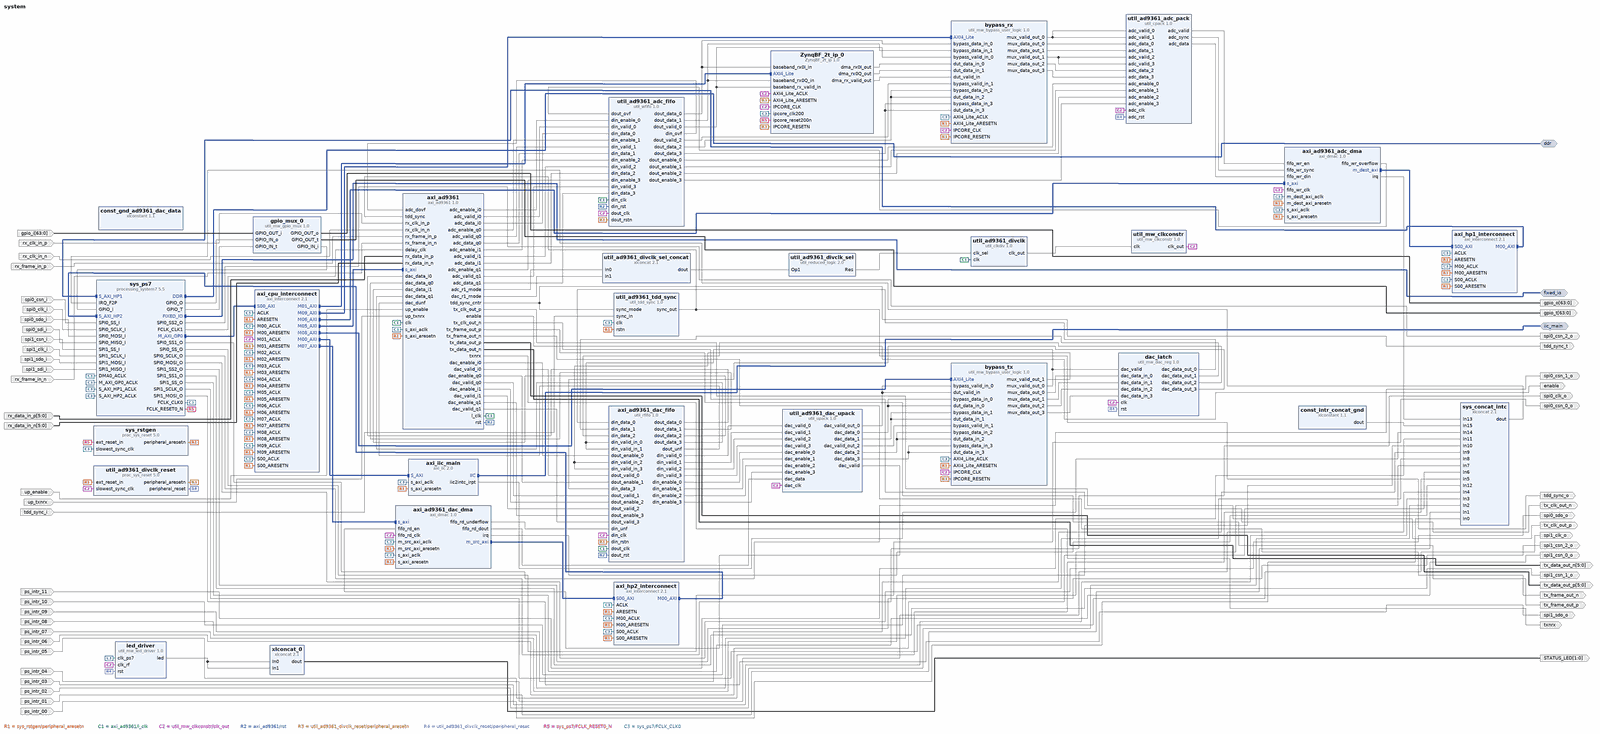
[diagram p0: block diagram of the top level, whole]
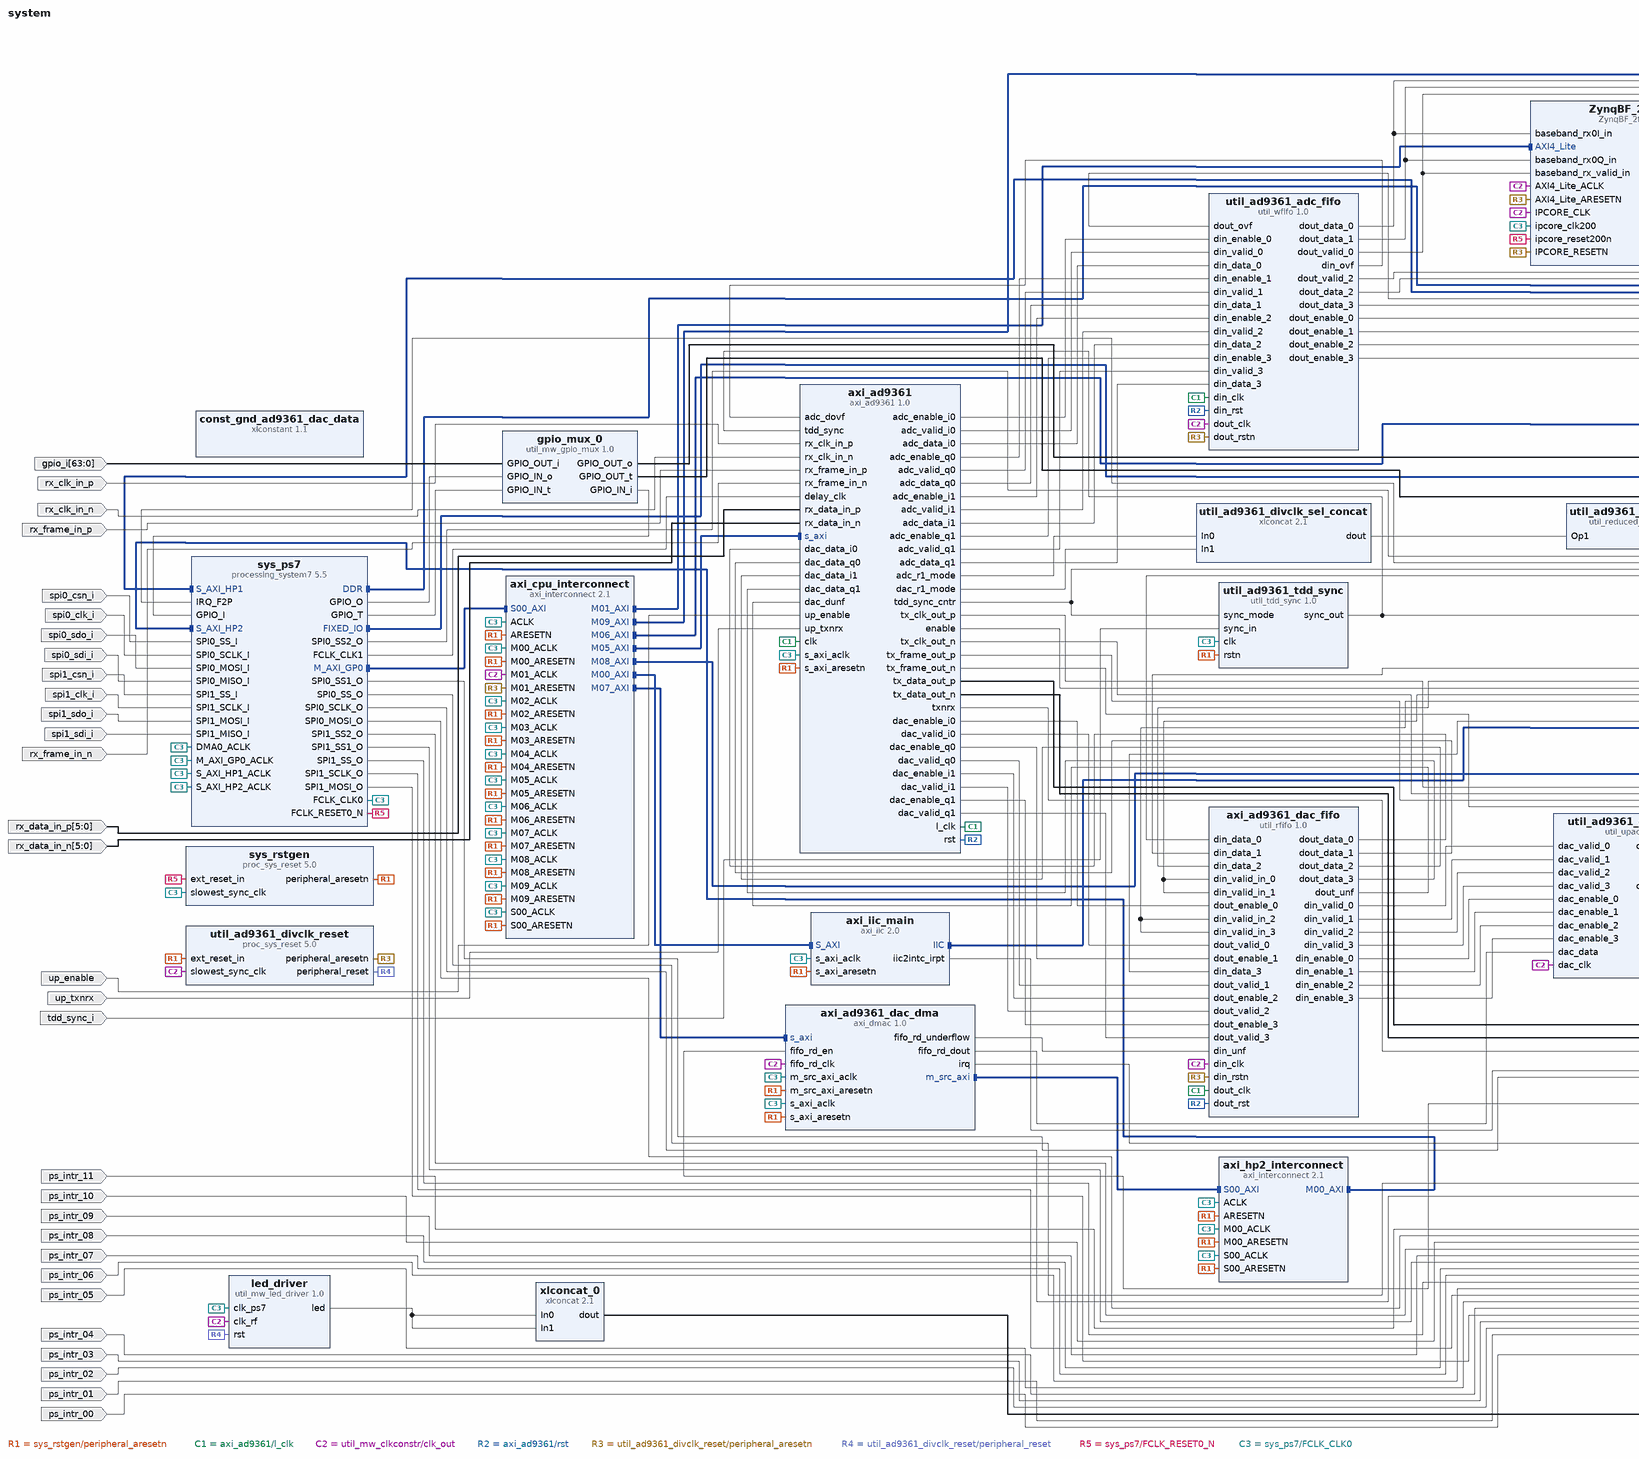
[diagram p1: block diagram of the top level, left part]
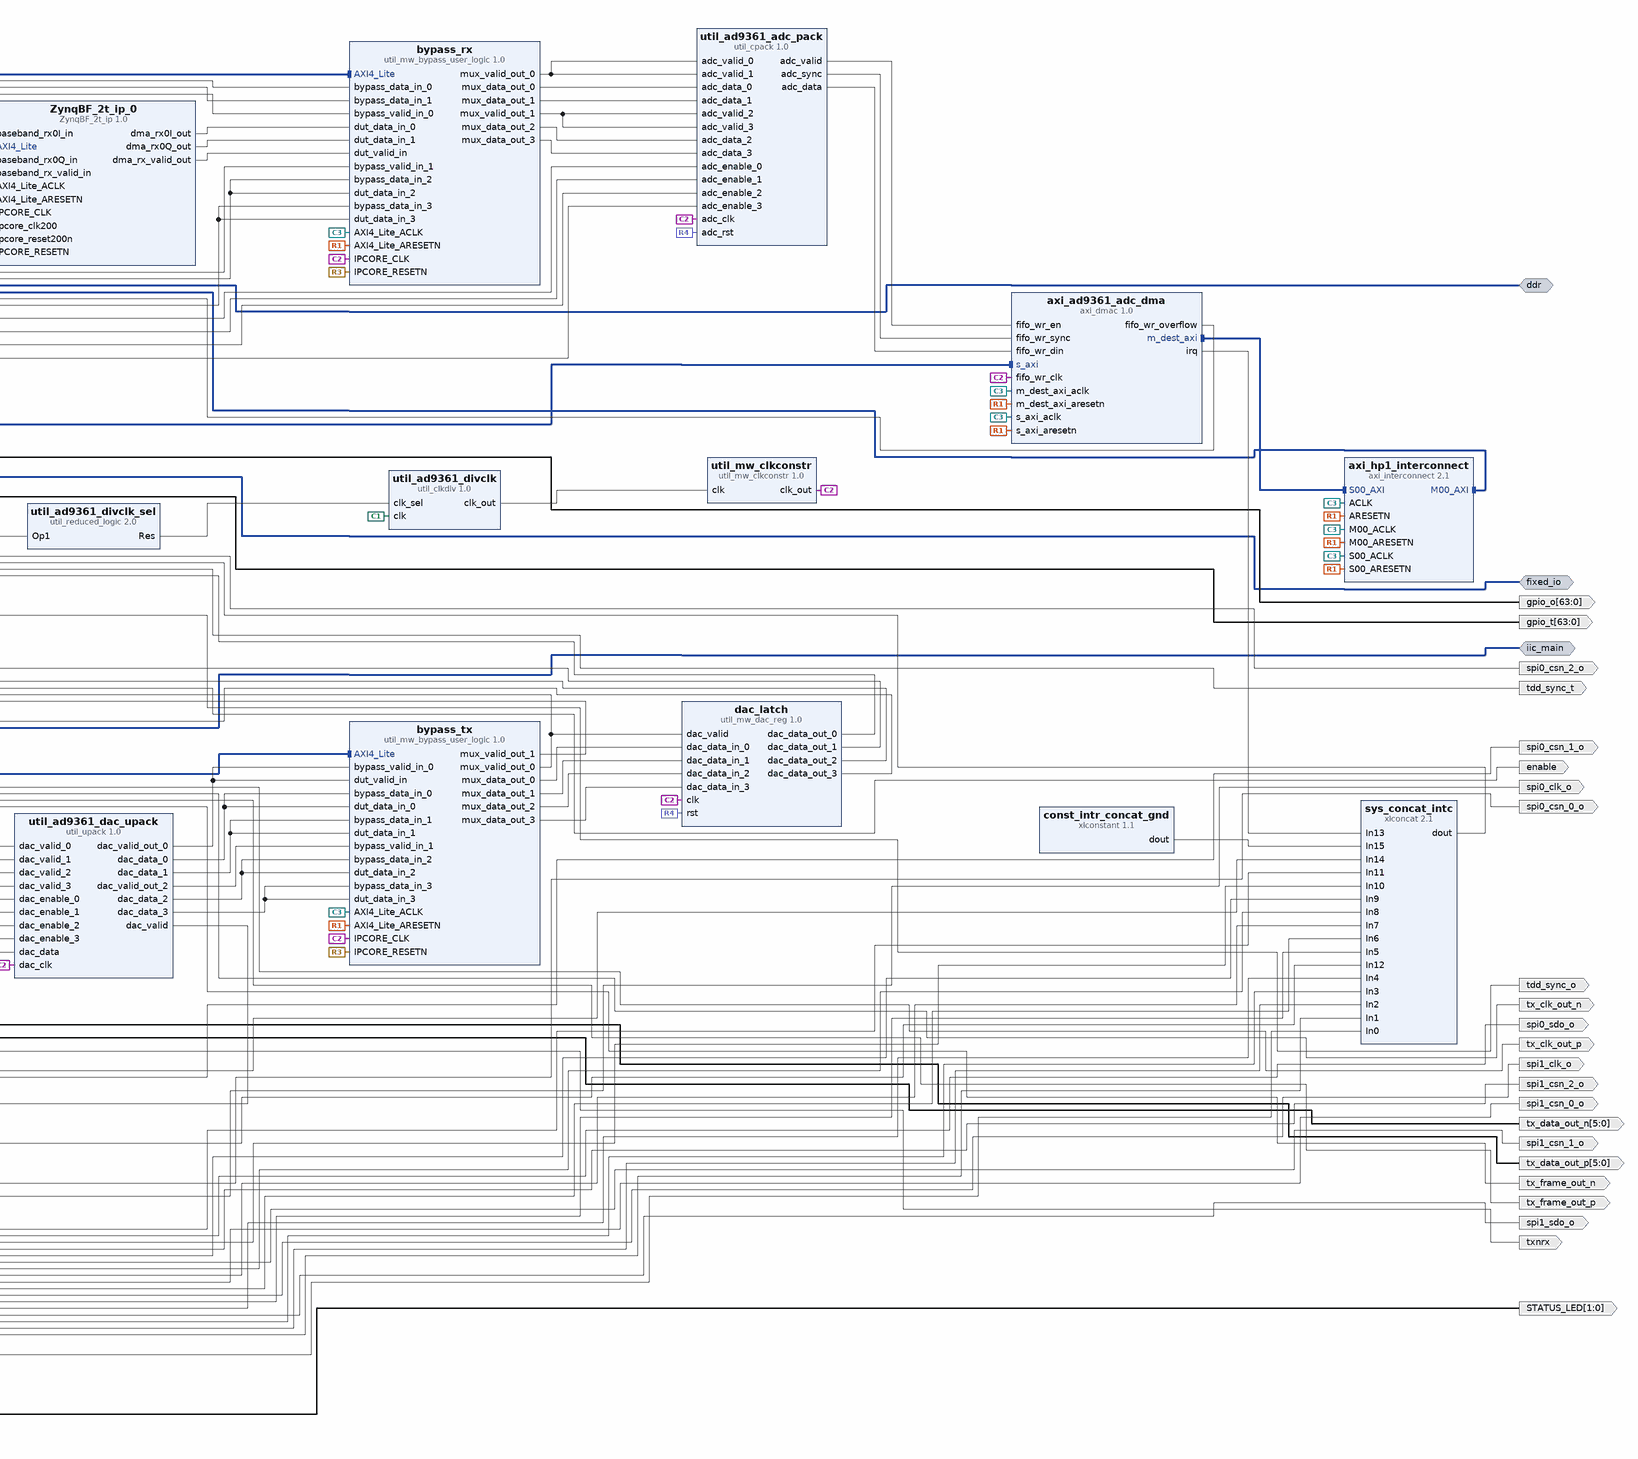
[diagram p2: block diagram of the top level, right part]
# Vivado block design system, xc7z045ffg900-2, Vivado 2017.4
create_bd_design system

create_bd_intf_port -mode Master -vlnv xilinx.com:interface:ddrx_rtl:1.0 ddr
create_bd_intf_port -mode Master -vlnv xilinx.com:interface:iic_rtl:1.0 iic_main
create_bd_intf_port -mode Master -vlnv xilinx.com:display_processing_system7:fixedio_rtl:1.0 fixed_io
create_bd_port -dir I -from 63 -to 0 gpio_i
create_bd_port -dir O -from 63 -to 0 gpio_o
create_bd_port -dir O -from 63 -to 0 gpio_t
create_bd_port -dir O spi0_csn_2_o
create_bd_port -dir O spi0_csn_1_o
create_bd_port -dir O spi0_csn_0_o
create_bd_port -dir I spi0_csn_i
create_bd_port -dir I spi0_clk_i
create_bd_port -dir O spi0_clk_o
create_bd_port -dir I spi0_sdo_i
create_bd_port -dir O spi0_sdo_o
create_bd_port -dir I spi0_sdi_i
create_bd_port -dir O spi1_csn_2_o
create_bd_port -dir O spi1_csn_1_o
create_bd_port -dir O spi1_csn_0_o
create_bd_port -dir I spi1_csn_i
create_bd_port -dir I spi1_clk_i
create_bd_port -dir O spi1_clk_o
create_bd_port -dir I spi1_sdo_i
create_bd_port -dir O spi1_sdo_o
create_bd_port -dir I spi1_sdi_i
create_bd_port -dir I -type intr ps_intr_11
create_bd_port -dir I -type intr ps_intr_10
create_bd_port -dir I -type intr ps_intr_09
create_bd_port -dir I -type intr ps_intr_08
create_bd_port -dir I -type intr ps_intr_07
create_bd_port -dir I -type intr ps_intr_06
create_bd_port -dir I -type intr ps_intr_05
create_bd_port -dir I -type intr ps_intr_04
create_bd_port -dir I -type intr ps_intr_03
create_bd_port -dir I -type intr ps_intr_02
create_bd_port -dir I -type intr ps_intr_01
create_bd_port -dir I -type intr ps_intr_00
create_bd_port -dir I rx_clk_in_p
create_bd_port -dir I rx_clk_in_n
create_bd_port -dir I rx_frame_in_p
create_bd_port -dir I rx_frame_in_n
create_bd_port -dir I -from 5 -to 0 rx_data_in_p
create_bd_port -dir I -from 5 -to 0 rx_data_in_n
create_bd_port -dir O tx_clk_out_p
create_bd_port -dir O tx_clk_out_n
create_bd_port -dir O tx_frame_out_p
create_bd_port -dir O tx_frame_out_n
create_bd_port -dir O -from 5 -to 0 tx_data_out_p
create_bd_port -dir O -from 5 -to 0 tx_data_out_n
create_bd_port -dir O enable
create_bd_port -dir O txnrx
create_bd_port -dir I up_enable
create_bd_port -dir I up_txnrx
create_bd_port -dir O tdd_sync_o
create_bd_port -dir O tdd_sync_t
create_bd_port -dir I tdd_sync_i
create_bd_port -dir O -from 1 -to 0 STATUS_LED

create_bd_cell -type ip -vlnv xilinx.com:ip:processing_system7:5.5 sys_ps7
set_property -dict [list \
  CONFIG.PCW_FCLK_CLK1_BUF TRUE \
  CONFIG.PCW_FCLK_CLK2_BUF TRUE \
  CONFIG.PCW_UIPARAM_DDR_FREQ_MHZ 533.333313 \
  CONFIG.PCW_APU_PERIPHERAL_FREQMHZ 667.000000 \
  CONFIG.PCW_SDIO_PERIPHERAL_FREQMHZ 50 \
  CONFIG.PCW_UART_PERIPHERAL_FREQMHZ 50 \
  CONFIG.PCW_I2C_PERIPHERAL_FREQMHZ 111.111115 \
  CONFIG.PCW_FPGA0_PERIPHERAL_FREQMHZ 100.0 \
  CONFIG.PCW_FPGA1_PERIPHERAL_FREQMHZ 200.0 \
  CONFIG.PCW_USE_S_AXI_HP1 1 \
  CONFIG.PCW_USE_S_AXI_HP2 1 \
  CONFIG.PCW_USE_DMA0 1 \
  CONFIG.PCW_USE_FABRIC_INTERRUPT 1 \
  CONFIG.PCW_EN_CLK1_PORT 1 \
  CONFIG.PCW_EN_CLK2_PORT 1 \
  CONFIG.PCW_EN_RST1_PORT 1 \
  CONFIG.PCW_EN_RST2_PORT 1 \
  CONFIG.PCW_IRQ_F2P_INTR 1 \
  CONFIG.PCW_IRQ_F2P_MODE REVERSE \
  CONFIG.PCW_PRESET_BANK0_VOLTAGE {LVCMOS 1.8V} \
  CONFIG.PCW_PRESET_BANK1_VOLTAGE {LVCMOS 1.8V} \
  CONFIG.PCW_UIPARAM_DDR_PARTNO Custom \
  CONFIG.PCW_QSPI_PERIPHERAL_ENABLE 1 \
  CONFIG.PCW_QSPI_QSPI_IO {MIO 1 .. 6} \
  CONFIG.PCW_QSPI_GRP_SINGLE_SS_ENABLE 0 \
  CONFIG.PCW_DUAL_PARALLEL_QSPI_DATA_MODE x8 \
  CONFIG.PCW_QSPI_GRP_IO1_ENABLE 1 \
  CONFIG.PCW_QSPI_GRP_IO1_IO {MIO 0 9 .. 13} \
  CONFIG.PCW_QSPI_GRP_FBCLK_ENABLE 1 \
  CONFIG.PCW_QSPI_GRP_FBCLK_IO {MIO 8} \
  CONFIG.PCW_QSPI_INTERNAL_HIGHADDRESS 0xFDFFFFFF \
  CONFIG.PCW_ENET0_PERIPHERAL_ENABLE 1 \
  CONFIG.PCW_ENET0_ENET0_IO {MIO 16 .. 27} \
  CONFIG.PCW_ENET0_GRP_MDIO_ENABLE 1 \
  CONFIG.PCW_ENET0_GRP_MDIO_IO {MIO 52 .. 53} \
  CONFIG.PCW_ENET_RESET_ENABLE 1 \
  CONFIG.PCW_ENET_RESET_SELECT {Share reset pin} \
  CONFIG.PCW_ENET0_RESET_ENABLE 1 \
  CONFIG.PCW_ENET0_RESET_IO {MIO 47} \
  CONFIG.PCW_SD0_PERIPHERAL_ENABLE 1 \
  CONFIG.PCW_SD0_SD0_IO {MIO 40 .. 45} \
  CONFIG.PCW_SD0_GRP_CD_ENABLE 1 \
  CONFIG.PCW_SD0_GRP_CD_IO {MIO 14} \
  CONFIG.PCW_SD0_GRP_WP_ENABLE 1 \
  CONFIG.PCW_SD0_GRP_WP_IO {MIO 15} \
  CONFIG.PCW_UART1_PERIPHERAL_ENABLE 1 \
  CONFIG.PCW_UART1_UART1_IO {MIO 48 .. 49} \
  CONFIG.PCW_SPI0_PERIPHERAL_ENABLE 1 \
  CONFIG.PCW_SPI0_SPI0_IO EMIO \
  CONFIG.PCW_SPI1_PERIPHERAL_ENABLE 1 \
  CONFIG.PCW_SPI1_SPI1_IO EMIO \
  CONFIG.PCW_USB0_PERIPHERAL_ENABLE 1 \
  CONFIG.PCW_USB0_USB0_IO {MIO 28 .. 39} \
  CONFIG.PCW_USB_RESET_ENABLE 1 \
  CONFIG.PCW_USB_RESET_SELECT {Share reset pin} \
  CONFIG.PCW_USB0_RESET_ENABLE 1 \
  CONFIG.PCW_USB0_RESET_IO {MIO 7} \
  CONFIG.PCW_I2C0_PERIPHERAL_ENABLE 1 \
  CONFIG.PCW_I2C0_I2C0_IO {MIO 50 .. 51} \
  CONFIG.PCW_I2C0_GRP_INT_ENABLE 0 \
  CONFIG.PCW_I2C0_RESET_ENABLE 1 \
  CONFIG.PCW_I2C0_RESET_IO {MIO 46} \
  CONFIG.PCW_I2C_RESET_ENABLE 1 \
  CONFIG.PCW_I2C_RESET_SELECT {Share reset pin} \
  CONFIG.PCW_GPIO_MIO_GPIO_ENABLE 1 \
  CONFIG.PCW_GPIO_MIO_GPIO_IO MIO \
  CONFIG.PCW_GPIO_EMIO_GPIO_ENABLE 1 \
  CONFIG.PCW_GPIO_EMIO_GPIO_IO 64 \
  CONFIG.PCW_ENET0_PERIPHERAL_FREQMHZ {100 Mbps} \
  CONFIG.preset ZC706 \
  CONFIG.PCW_FPGA_FCLK1_ENABLE 1 \
  CONFIG.PCW_FPGA_FCLK2_ENABLE 1 \
] [get_bd_cells sys_ps7]
# 243 more settings of sys_ps7 are not shown: defaults, MIO pin electricals, DDR timing, and values the tool derives
create_bd_cell -type ip -vlnv xilinx.com:ip:axi_iic:2.0 axi_iic_main
set_property -dict {CONFIG.USE_BOARD_FLOW true CONFIG.IIC_BOARD_INTERFACE Custom} [get_bd_cells axi_iic_main]
create_bd_cell -type ip -vlnv xilinx.com:ip:xlconcat:2.1 sys_concat_intc
set_property -dict {CONFIG.NUM_PORTS 16} [get_bd_cells sys_concat_intc]
create_bd_cell -type ip -vlnv xilinx.com:ip:proc_sys_reset:5.0 sys_rstgen
set_property -dict {CONFIG.C_EXT_RST_WIDTH 1} [get_bd_cells sys_rstgen]
create_bd_cell -type ip -vlnv xilinx.com:ip:axi_interconnect:2.1 axi_cpu_interconnect
set_property -dict {CONFIG.NUM_MI 10 CONFIG.M01_HAS_REGSLICE 4 CONFIG.M01_HAS_DATA_FIFO 0} [get_bd_cells axi_cpu_interconnect]
create_bd_cell -type ip -vlnv analog.com:user:axi_ad9361:1.0 axi_ad9361
set_property -dict {CONFIG.ID 0 CONFIG.ADC_INIT_DELAY 20} [get_bd_cells axi_ad9361]
create_bd_cell -type ip -vlnv analog.com:user:util_tdd_sync:1.0 util_ad9361_tdd_sync
set_property -dict {CONFIG.TDD_SYNC_PERIOD 10000000} [get_bd_cells util_ad9361_tdd_sync]
create_bd_cell -type ip -vlnv xilinx.com:ip:xlconcat:2.1 util_ad9361_divclk_sel_concat
set_property -dict {CONFIG.NUM_PORTS 2} [get_bd_cells util_ad9361_divclk_sel_concat]
create_bd_cell -type ip -vlnv xilinx.com:ip:util_reduced_logic:2.0 util_ad9361_divclk_sel
set_property -dict {CONFIG.C_SIZE 2} [get_bd_cells util_ad9361_divclk_sel]
create_bd_cell -type ip -vlnv analog.com:user:util_clkdiv:1.0 util_ad9361_divclk
create_bd_cell -type ip -vlnv xilinx.com:ip:proc_sys_reset:5.0 util_ad9361_divclk_reset
create_bd_cell -type ip -vlnv analog.com:user:util_wfifo:1.0 util_ad9361_adc_fifo
set_property -dict [list \
  CONFIG.NUM_OF_CHANNELS 4 \
  CONFIG.DIN_DATA_WIDTH 16 \
  CONFIG.DOUT_DATA_WIDTH 16 \
  CONFIG.DIN_ADDRESS_WIDTH 4 \
] [get_bd_cells util_ad9361_adc_fifo]
create_bd_cell -type ip -vlnv analog.com:user:util_cpack:1.0 util_ad9361_adc_pack
set_property -dict {CONFIG.CHANNEL_DATA_WIDTH 16 CONFIG.NUM_OF_CHANNELS 4} [get_bd_cells util_ad9361_adc_pack]
create_bd_cell -type ip -vlnv analog.com:user:axi_dmac:1.0 axi_ad9361_adc_dma
set_property -dict [list \
  CONFIG.DMA_DATA_WIDTH_SRC 64 \
  CONFIG.DMA_2D_TRANSFER false \
  CONFIG.AXI_SLICE_DEST false \
  CONFIG.AXI_SLICE_SRC false \
  CONFIG.SYNC_TRANSFER_START true \
  CONFIG.CYCLIC false \
  CONFIG.DMA_TYPE_DEST 0 \
  CONFIG.DMA_TYPE_SRC 2 \
] [get_bd_cells axi_ad9361_adc_dma]
create_bd_cell -type ip -vlnv analog.com:user:util_rfifo:1.0 axi_ad9361_dac_fifo
set_property -dict [list \
  CONFIG.DIN_DATA_WIDTH 16 \
  CONFIG.DOUT_DATA_WIDTH 16 \
  CONFIG.DIN_ADDRESS_WIDTH 4 \
] [get_bd_cells axi_ad9361_dac_fifo]
create_bd_cell -type ip -vlnv analog.com:user:util_upack:1.0 util_ad9361_dac_upack
set_property -dict {CONFIG.CHANNEL_DATA_WIDTH 16 CONFIG.NUM_OF_CHANNELS 4} [get_bd_cells util_ad9361_dac_upack]
create_bd_cell -type ip -vlnv analog.com:user:axi_dmac:1.0 axi_ad9361_dac_dma
set_property -dict [list \
  CONFIG.DMA_DATA_WIDTH_DEST 64 \
  CONFIG.DMA_2D_TRANSFER false \
  CONFIG.AXI_SLICE_DEST true \
  CONFIG.AXI_SLICE_SRC false \
  CONFIG.CYCLIC true \
  CONFIG.DMA_TYPE_DEST 2 \
  CONFIG.DMA_TYPE_SRC 0 \
] [get_bd_cells axi_ad9361_dac_dma]
create_bd_cell -type ip -vlnv xilinx.com:ip:axi_interconnect:2.1 axi_hp1_interconnect
set_property -dict {CONFIG.NUM_SI 1 CONFIG.NUM_MI 1} [get_bd_cells axi_hp1_interconnect]
create_bd_cell -type ip -vlnv xilinx.com:ip:axi_interconnect:2.1 axi_hp2_interconnect
set_property -dict {CONFIG.NUM_SI 1 CONFIG.NUM_MI 1} [get_bd_cells axi_hp2_interconnect]
create_bd_cell -type ip -vlnv xilinx.com:ip:xlconstant:1.1 const_intr_concat_gnd
set_property -dict {CONFIG.CONST_WIDTH 1 CONFIG.CONST_VAL 0} [get_bd_cells const_intr_concat_gnd]
create_bd_cell -type ip -vlnv mathworks.com:user:util_mw_dac_reg:1.0 dac_latch
set_property -dict {CONFIG.NUM_CHAN 4} [get_bd_cells dac_latch]
create_bd_cell -type ip -vlnv mathworks.com:user:util_mw_bypass_user_logic:1.0 bypass_tx
set_property -dict {CONFIG.NUM_CHAN 4} [get_bd_cells bypass_tx]
create_bd_cell -type ip -vlnv mathworks.com:user:util_mw_bypass_user_logic:1.0 bypass_rx
set_property -dict {CONFIG.NUM_CHAN 4} [get_bd_cells bypass_rx]
create_bd_cell -type ip -vlnv mathworks.com:user:util_mw_gpio_mux:1.0 gpio_mux_0
set_property -dict [list \
  CONFIG.GPIO_IO_WIDTH 64 \
  CONFIG.NUM_PORTS 5 \
  CONFIG.PORT_0_WIDTH 1 \
  CONFIG.PORT_0_OFFSET 47 \
  CONFIG.PORT_0_TYPE 4 \
  CONFIG.PORT_1_WIDTH 1 \
  CONFIG.PORT_1_OFFSET 48 \
  CONFIG.PORT_1_TYPE 4 \
  CONFIG.PORT_2_WIDTH 1 \
  CONFIG.PORT_2_OFFSET 44 \
  CONFIG.PORT_2_TYPE 4 \
  CONFIG.PORT_3_WIDTH 8 \
  CONFIG.PORT_3_OFFSET 32 \
  CONFIG.PORT_3_TYPE 4 \
  CONFIG.PORT_4_WIDTH 4 \
  CONFIG.PORT_4_OFFSET 40 \
  CONFIG.PORT_4_TYPE 4 \
] [get_bd_cells gpio_mux_0]
create_bd_cell -type ip -vlnv mathworks.com:user:util_mw_clkconstr:1.0 util_mw_clkconstr
set_property -dict {CONFIG.CLKOUT0_REQUESTED_OUT_FREQ 61.440} [get_bd_cells util_mw_clkconstr]
create_bd_cell -type ip -vlnv mathworks.com:user:util_mw_led_driver:1.0 led_driver
create_bd_cell -type ip -vlnv xilinx.com:ip:xlconstant:1.1 const_gnd_ad9361_dac_data
set_property -dict {CONFIG.CONST_WIDTH 16 CONFIG.CONST_VAL 0} [get_bd_cells const_gnd_ad9361_dac_data]
create_bd_cell -type ip -vlnv xilinx.com:ip:xlconcat:2.1 xlconcat_0
create_bd_cell -type ip -vlnv user.org:user:ZynqBF_2t_ip:1.0 ZynqBF_2t_ip_0

# ---- connections ----

connect_bd_intf_net [get_bd_intf_pins axi_cpu_interconnect/S00_AXI] [get_bd_intf_pins sys_ps7/M_AXI_GP0]
connect_bd_intf_net [get_bd_intf_pins axi_cpu_interconnect/M00_AXI] [get_bd_intf_pins axi_iic_main/S_AXI]
connect_bd_intf_net [get_bd_intf_pins axi_cpu_interconnect/M05_AXI] [get_bd_intf_pins axi_ad9361/s_axi]
connect_bd_intf_net [get_bd_intf_pins axi_cpu_interconnect/M06_AXI] [get_bd_intf_pins axi_ad9361_adc_dma/s_axi]
connect_bd_intf_net [get_bd_intf_pins axi_cpu_interconnect/M07_AXI] [get_bd_intf_pins axi_ad9361_dac_dma/s_axi]
connect_bd_intf_net [get_bd_intf_pins axi_hp1_interconnect/M00_AXI] [get_bd_intf_pins sys_ps7/S_AXI_HP1]
connect_bd_intf_net [get_bd_intf_pins axi_hp1_interconnect/S00_AXI] [get_bd_intf_pins axi_ad9361_adc_dma/m_dest_axi]
connect_bd_intf_net [get_bd_intf_pins axi_hp2_interconnect/M00_AXI] [get_bd_intf_pins sys_ps7/S_AXI_HP2]
connect_bd_intf_net [get_bd_intf_pins axi_hp2_interconnect/S00_AXI] [get_bd_intf_pins axi_ad9361_dac_dma/m_src_axi]
connect_bd_intf_net [get_bd_intf_pins axi_cpu_interconnect/M08_AXI] [get_bd_intf_pins bypass_tx/AXI4_Lite]
connect_bd_intf_net [get_bd_intf_pins axi_cpu_interconnect/M09_AXI] [get_bd_intf_pins bypass_rx/AXI4_Lite]
connect_bd_intf_net [get_bd_intf_pins ZynqBF_2t_ip_0/AXI4_Lite] [get_bd_intf_pins axi_cpu_interconnect/M01_AXI]
connect_bd_intf_net [get_bd_intf_ports ddr] [get_bd_intf_pins sys_ps7/DDR]
connect_bd_intf_net [get_bd_intf_ports iic_main] [get_bd_intf_pins axi_iic_main/IIC]
connect_bd_intf_net [get_bd_intf_ports fixed_io] [get_bd_intf_pins sys_ps7/FIXED_IO]
connect_bd_net -net sys_200m_clk [get_bd_pins sys_ps7/FCLK_CLK1] [get_bd_pins axi_ad9361/delay_clk]
connect_bd_net -net sys_cpu_resetn [get_bd_pins sys_rstgen/peripheral_aresetn] \
  [get_bd_pins axi_iic_main/s_axi_aresetn] [get_bd_pins util_ad9361_tdd_sync/rstn] \
  [get_bd_pins util_ad9361_divclk_reset/ext_reset_in] [get_bd_pins axi_ad9361_adc_dma/m_dest_axi_aresetn] \
  [get_bd_pins axi_ad9361_dac_dma/m_src_axi_aresetn] [get_bd_pins axi_ad9361/s_axi_aresetn] \
  [get_bd_pins axi_ad9361_adc_dma/s_axi_aresetn] [get_bd_pins axi_ad9361_dac_dma/s_axi_aresetn] \
  [get_bd_pins bypass_tx/AXI4_Lite_ARESETN] [get_bd_pins bypass_rx/AXI4_Lite_ARESETN] \
  [get_bd_pins axi_cpu_interconnect/ARESETN] [get_bd_pins axi_cpu_interconnect/S00_ARESETN] \
  [get_bd_pins axi_cpu_interconnect/M00_ARESETN] [get_bd_pins axi_cpu_interconnect/M02_ARESETN] \
  [get_bd_pins axi_cpu_interconnect/M03_ARESETN] [get_bd_pins axi_cpu_interconnect/M04_ARESETN] \
  [get_bd_pins axi_cpu_interconnect/M05_ARESETN] [get_bd_pins axi_cpu_interconnect/M06_ARESETN] \
  [get_bd_pins axi_cpu_interconnect/M07_ARESETN] [get_bd_pins axi_hp1_interconnect/ARESETN] \
  [get_bd_pins axi_hp1_interconnect/M00_ARESETN] [get_bd_pins axi_hp1_interconnect/S00_ARESETN] \
  [get_bd_pins axi_hp2_interconnect/ARESETN] [get_bd_pins axi_hp2_interconnect/M00_ARESETN] \
  [get_bd_pins axi_hp2_interconnect/S00_ARESETN] [get_bd_pins axi_cpu_interconnect/M08_ARESETN] \
  [get_bd_pins axi_cpu_interconnect/M09_ARESETN]
connect_bd_net [get_bd_ports gpio_i] [get_bd_pins gpio_mux_0/GPIO_OUT_i]
connect_bd_net -net sys_ps7_GPIO_O [get_bd_pins gpio_mux_0/GPIO_OUT_o] [get_bd_ports gpio_o]
connect_bd_net -net sys_ps7_GPIO_T [get_bd_pins gpio_mux_0/GPIO_OUT_t] [get_bd_ports gpio_t]
connect_bd_net [get_bd_pins sys_ps7/SPI0_SS2_O] [get_bd_ports spi0_csn_2_o]
connect_bd_net [get_bd_pins sys_ps7/SPI0_SS1_O] [get_bd_ports spi0_csn_1_o]
connect_bd_net [get_bd_pins sys_ps7/SPI0_SS_O] [get_bd_ports spi0_csn_0_o]
connect_bd_net [get_bd_ports spi0_csn_i] [get_bd_pins sys_ps7/SPI0_SS_I]
connect_bd_net [get_bd_ports spi0_clk_i] [get_bd_pins sys_ps7/SPI0_SCLK_I]
connect_bd_net [get_bd_pins sys_ps7/SPI0_SCLK_O] [get_bd_ports spi0_clk_o]
connect_bd_net [get_bd_ports spi0_sdo_i] [get_bd_pins sys_ps7/SPI0_MOSI_I]
connect_bd_net [get_bd_pins sys_ps7/SPI0_MOSI_O] [get_bd_ports spi0_sdo_o]
connect_bd_net [get_bd_ports spi0_sdi_i] [get_bd_pins sys_ps7/SPI0_MISO_I]
connect_bd_net [get_bd_pins sys_ps7/SPI1_SS2_O] [get_bd_ports spi1_csn_2_o]
connect_bd_net [get_bd_pins sys_ps7/SPI1_SS1_O] [get_bd_ports spi1_csn_1_o]
connect_bd_net [get_bd_pins sys_ps7/SPI1_SS_O] [get_bd_ports spi1_csn_0_o]
connect_bd_net [get_bd_ports spi1_csn_i] [get_bd_pins sys_ps7/SPI1_SS_I]
connect_bd_net [get_bd_ports spi1_clk_i] [get_bd_pins sys_ps7/SPI1_SCLK_I]
connect_bd_net [get_bd_pins sys_ps7/SPI1_SCLK_O] [get_bd_ports spi1_clk_o]
connect_bd_net [get_bd_ports spi1_sdo_i] [get_bd_pins sys_ps7/SPI1_MOSI_I]
connect_bd_net [get_bd_pins sys_ps7/SPI1_MOSI_O] [get_bd_ports spi1_sdo_o]
connect_bd_net [get_bd_ports spi1_sdi_i] [get_bd_pins sys_ps7/SPI1_MISO_I]
connect_bd_net [get_bd_pins sys_concat_intc/dout] [get_bd_pins sys_ps7/IRQ_F2P]
connect_bd_net [get_bd_pins axi_iic_main/iic2intc_irpt] [get_bd_pins sys_concat_intc/In14]
connect_bd_net -net ps_intr_11_1 [get_bd_ports ps_intr_11] [get_bd_pins sys_concat_intc/In11]
connect_bd_net -net ps_intr_10_1 [get_bd_ports ps_intr_10] [get_bd_pins sys_concat_intc/In10]
connect_bd_net -net ps_intr_09_1 [get_bd_ports ps_intr_09] [get_bd_pins sys_concat_intc/In9]
connect_bd_net -net ps_intr_08_1 [get_bd_ports ps_intr_08] [get_bd_pins sys_concat_intc/In8]
connect_bd_net -net ps_intr_07_1 [get_bd_ports ps_intr_07] [get_bd_pins sys_concat_intc/In7]
connect_bd_net -net ps_intr_06_1 [get_bd_ports ps_intr_06] [get_bd_pins sys_concat_intc/In6]
connect_bd_net -net ps_intr_05_1 [get_bd_ports ps_intr_05] [get_bd_pins sys_concat_intc/In5]
connect_bd_net -net ps_intr_04_1 [get_bd_ports ps_intr_04] [get_bd_pins sys_concat_intc/In4]
connect_bd_net -net ps_intr_03_1 [get_bd_ports ps_intr_03] [get_bd_pins sys_concat_intc/In3]
connect_bd_net -net ps_intr_02_1 [get_bd_ports ps_intr_02] [get_bd_pins sys_concat_intc/In2]
connect_bd_net -net ps_intr_01_1 [get_bd_ports ps_intr_01] [get_bd_pins sys_concat_intc/In1]
connect_bd_net -net ps_intr_00_1 [get_bd_ports ps_intr_00] [get_bd_pins sys_concat_intc/In0]
connect_bd_net [get_bd_pins axi_ad9361/l_clk] \
  [get_bd_pins axi_ad9361/clk] [get_bd_pins util_ad9361_divclk/clk] [get_bd_pins util_ad9361_adc_fifo/din_clk] \
  [get_bd_pins axi_ad9361_dac_fifo/dout_clk]
connect_bd_net [get_bd_ports rx_clk_in_p] [get_bd_pins axi_ad9361/rx_clk_in_p]
connect_bd_net [get_bd_ports rx_clk_in_n] [get_bd_pins axi_ad9361/rx_clk_in_n]
connect_bd_net [get_bd_ports rx_frame_in_p] [get_bd_pins axi_ad9361/rx_frame_in_p]
connect_bd_net [get_bd_ports rx_frame_in_n] [get_bd_pins axi_ad9361/rx_frame_in_n]
connect_bd_net [get_bd_ports rx_data_in_p] [get_bd_pins axi_ad9361/rx_data_in_p]
connect_bd_net [get_bd_ports rx_data_in_n] [get_bd_pins axi_ad9361/rx_data_in_n]
connect_bd_net [get_bd_pins axi_ad9361/tx_clk_out_p] [get_bd_ports tx_clk_out_p]
connect_bd_net [get_bd_pins axi_ad9361/tx_clk_out_n] [get_bd_ports tx_clk_out_n]
connect_bd_net [get_bd_pins axi_ad9361/tx_frame_out_p] [get_bd_ports tx_frame_out_p]
connect_bd_net [get_bd_pins axi_ad9361/tx_frame_out_n] [get_bd_ports tx_frame_out_n]
connect_bd_net [get_bd_pins axi_ad9361/tx_data_out_p] [get_bd_ports tx_data_out_p]
connect_bd_net [get_bd_pins axi_ad9361/tx_data_out_n] [get_bd_ports tx_data_out_n]
connect_bd_net [get_bd_pins axi_ad9361/enable] [get_bd_ports enable]
connect_bd_net [get_bd_pins axi_ad9361/txnrx] [get_bd_ports txnrx]
connect_bd_net [get_bd_ports up_enable] [get_bd_pins axi_ad9361/up_enable]
connect_bd_net [get_bd_ports up_txnrx] [get_bd_pins axi_ad9361/up_txnrx]
connect_bd_net [get_bd_pins util_ad9361_tdd_sync/sync_out] [get_bd_ports tdd_sync_o] [get_bd_pins axi_ad9361/tdd_sync]
connect_bd_net [get_bd_pins axi_ad9361/tdd_sync_cntr] [get_bd_ports tdd_sync_t] [get_bd_pins util_ad9361_tdd_sync/sync_mode]
connect_bd_net [get_bd_ports tdd_sync_i] [get_bd_pins util_ad9361_tdd_sync/sync_in]
connect_bd_net [get_bd_pins axi_ad9361/adc_r1_mode] [get_bd_pins util_ad9361_divclk_sel_concat/In0]
connect_bd_net [get_bd_pins axi_ad9361/dac_r1_mode] [get_bd_pins util_ad9361_divclk_sel_concat/In1]
connect_bd_net [get_bd_pins util_ad9361_divclk_sel_concat/dout] [get_bd_pins util_ad9361_divclk_sel/Op1]
connect_bd_net [get_bd_pins util_ad9361_divclk_sel/Res] [get_bd_pins util_ad9361_divclk/clk_sel]
connect_bd_net -net util_ad9361_divclk_clk_out [get_bd_pins util_mw_clkconstr/clk_out] \
  [get_bd_pins util_ad9361_divclk_reset/slowest_sync_clk] [get_bd_pins util_ad9361_adc_fifo/dout_clk] \
  [get_bd_pins util_ad9361_adc_pack/adc_clk] [get_bd_pins axi_ad9361_adc_dma/fifo_wr_clk] \
  [get_bd_pins axi_ad9361_dac_fifo/din_clk] [get_bd_pins util_ad9361_dac_upack/dac_clk] \
  [get_bd_pins axi_ad9361_dac_dma/fifo_rd_clk] [get_bd_pins dac_latch/clk] [get_bd_pins bypass_tx/IPCORE_CLK] \
  [get_bd_pins bypass_rx/IPCORE_CLK] [get_bd_pins led_driver/clk_rf] [get_bd_pins axi_cpu_interconnect/M01_ACLK] \
  [get_bd_pins ZynqBF_2t_ip_0/AXI4_Lite_ACLK] [get_bd_pins ZynqBF_2t_ip_0/IPCORE_CLK]
connect_bd_net [get_bd_pins axi_ad9361/rst] [get_bd_pins util_ad9361_adc_fifo/din_rst] [get_bd_pins axi_ad9361_dac_fifo/dout_rst]
connect_bd_net [get_bd_pins util_ad9361_divclk_reset/peripheral_aresetn] \
  [get_bd_pins util_ad9361_adc_fifo/dout_rstn] [get_bd_pins axi_ad9361_dac_fifo/din_rstn] \
  [get_bd_pins bypass_tx/IPCORE_RESETN] [get_bd_pins bypass_rx/IPCORE_RESETN] [get_bd_pins axi_cpu_interconnect/M01_ARESETN] \
  [get_bd_pins ZynqBF_2t_ip_0/AXI4_Lite_ARESETN] [get_bd_pins ZynqBF_2t_ip_0/IPCORE_RESETN]
connect_bd_net [get_bd_pins axi_ad9361/adc_enable_i0] [get_bd_pins util_ad9361_adc_fifo/din_enable_0]
connect_bd_net [get_bd_pins axi_ad9361/adc_valid_i0] [get_bd_pins util_ad9361_adc_fifo/din_valid_0]
connect_bd_net [get_bd_pins axi_ad9361/adc_data_i0] [get_bd_pins util_ad9361_adc_fifo/din_data_0]
connect_bd_net [get_bd_pins axi_ad9361/adc_enable_q0] [get_bd_pins util_ad9361_adc_fifo/din_enable_1]
connect_bd_net [get_bd_pins axi_ad9361/adc_valid_q0] [get_bd_pins util_ad9361_adc_fifo/din_valid_1]
connect_bd_net [get_bd_pins axi_ad9361/adc_data_q0] [get_bd_pins util_ad9361_adc_fifo/din_data_1]
connect_bd_net [get_bd_pins axi_ad9361/adc_enable_i1] [get_bd_pins util_ad9361_adc_fifo/din_enable_2]
connect_bd_net [get_bd_pins axi_ad9361/adc_valid_i1] [get_bd_pins util_ad9361_adc_fifo/din_valid_2]
connect_bd_net [get_bd_pins axi_ad9361/adc_data_i1] [get_bd_pins util_ad9361_adc_fifo/din_data_2]
connect_bd_net [get_bd_pins axi_ad9361/adc_enable_q1] [get_bd_pins util_ad9361_adc_fifo/din_enable_3]
connect_bd_net [get_bd_pins axi_ad9361/adc_valid_q1] [get_bd_pins util_ad9361_adc_fifo/din_valid_3]
connect_bd_net [get_bd_pins axi_ad9361/adc_data_q1] [get_bd_pins util_ad9361_adc_fifo/din_data_3]
connect_bd_net [get_bd_pins util_ad9361_adc_fifo/din_ovf] [get_bd_pins axi_ad9361/adc_dovf]
connect_bd_net [get_bd_pins util_ad9361_divclk_reset/peripheral_reset] \
  [get_bd_pins util_ad9361_adc_pack/adc_rst] [get_bd_pins dac_latch/rst] [get_bd_pins led_driver/rst]
connect_bd_net [get_bd_pins util_ad9361_adc_pack/adc_valid] [get_bd_pins axi_ad9361_adc_dma/fifo_wr_en]
connect_bd_net [get_bd_pins util_ad9361_adc_pack/adc_sync] [get_bd_pins axi_ad9361_adc_dma/fifo_wr_sync]
connect_bd_net [get_bd_pins util_ad9361_adc_pack/adc_data] [get_bd_pins axi_ad9361_adc_dma/fifo_wr_din]
connect_bd_net [get_bd_pins axi_ad9361_adc_dma/fifo_wr_overflow] [get_bd_pins util_ad9361_adc_fifo/dout_ovf]
connect_bd_net [get_bd_pins axi_ad9361/dac_enable_i0] [get_bd_pins axi_ad9361_dac_fifo/dout_enable_0]
connect_bd_net [get_bd_pins axi_ad9361/dac_valid_i0] [get_bd_pins axi_ad9361_dac_fifo/dout_valid_0]
connect_bd_net [get_bd_pins axi_ad9361_dac_fifo/dout_data_0] [get_bd_pins axi_ad9361/dac_data_i0]
connect_bd_net [get_bd_pins axi_ad9361/dac_enable_q0] [get_bd_pins axi_ad9361_dac_fifo/dout_enable_1]
connect_bd_net [get_bd_pins axi_ad9361/dac_valid_q0] [get_bd_pins axi_ad9361_dac_fifo/dout_valid_1]
connect_bd_net [get_bd_pins axi_ad9361_dac_fifo/dout_data_1] [get_bd_pins axi_ad9361/dac_data_q0]
connect_bd_net [get_bd_pins axi_ad9361/dac_enable_i1] [get_bd_pins axi_ad9361_dac_fifo/dout_enable_2]
connect_bd_net [get_bd_pins axi_ad9361/dac_valid_i1] [get_bd_pins axi_ad9361_dac_fifo/dout_valid_2]
connect_bd_net [get_bd_pins axi_ad9361_dac_fifo/dout_data_2] [get_bd_pins axi_ad9361/dac_data_i1]
connect_bd_net [get_bd_pins axi_ad9361/dac_enable_q1] [get_bd_pins axi_ad9361_dac_fifo/dout_enable_3]
connect_bd_net [get_bd_pins axi_ad9361/dac_valid_q1] [get_bd_pins axi_ad9361_dac_fifo/dout_valid_3]
connect_bd_net [get_bd_pins axi_ad9361_dac_fifo/dout_data_3] [get_bd_pins axi_ad9361/dac_data_q1]
connect_bd_net [get_bd_pins axi_ad9361_dac_fifo/dout_unf] [get_bd_pins axi_ad9361/dac_dunf]
connect_bd_net [get_bd_pins axi_ad9361_dac_fifo/din_valid_0] [get_bd_pins util_ad9361_dac_upack/dac_valid_0]
connect_bd_net [get_bd_pins axi_ad9361_dac_fifo/din_valid_1] [get_bd_pins util_ad9361_dac_upack/dac_valid_1]
connect_bd_net [get_bd_pins axi_ad9361_dac_fifo/din_valid_2] [get_bd_pins util_ad9361_dac_upack/dac_valid_2]
connect_bd_net [get_bd_pins axi_ad9361_dac_fifo/din_valid_3] [get_bd_pins util_ad9361_dac_upack/dac_valid_3]
connect_bd_net [get_bd_pins util_ad9361_dac_upack/dac_valid] [get_bd_pins axi_ad9361_dac_dma/fifo_rd_en]
connect_bd_net [get_bd_pins axi_ad9361_dac_dma/fifo_rd_dout] [get_bd_pins util_ad9361_dac_upack/dac_data]
connect_bd_net [get_bd_pins axi_ad9361_dac_dma/fifo_rd_underflow] [get_bd_pins axi_ad9361_dac_fifo/din_unf]
connect_bd_net [get_bd_pins axi_ad9361_adc_dma/irq] [get_bd_pins sys_concat_intc/In13]
connect_bd_net [get_bd_pins axi_ad9361_dac_dma/irq] [get_bd_pins sys_concat_intc/In12]
connect_bd_net -net const_intr_concat_gnd [get_bd_pins const_intr_concat_gnd/dout] [get_bd_pins sys_concat_intc/In15]
connect_bd_net -net dac_latch_dac_data_out_0_net [get_bd_pins dac_latch/dac_data_out_0] [get_bd_pins axi_ad9361_dac_fifo/din_data_0]
connect_bd_net -net bypass_tx_mux_data_out_0_net [get_bd_pins bypass_tx/mux_data_out_0] [get_bd_pins dac_latch/dac_data_in_0]
connect_bd_net -net dac_latch_dac_data_out_1_net [get_bd_pins dac_latch/dac_data_out_1] [get_bd_pins axi_ad9361_dac_fifo/din_data_1]
connect_bd_net -net bypass_tx_mux_data_out_1_net [get_bd_pins bypass_tx/mux_data_out_1] [get_bd_pins dac_latch/dac_data_in_1]
connect_bd_net -net dac_latch_dac_data_out_2_net [get_bd_pins dac_latch/dac_data_out_2] [get_bd_pins axi_ad9361_dac_fifo/din_data_2]
connect_bd_net -net bypass_tx_mux_data_out_2_net [get_bd_pins bypass_tx/mux_data_out_2] [get_bd_pins dac_latch/dac_data_in_2]
connect_bd_net -net dac_latch_dac_data_out_3_net [get_bd_pins dac_latch/dac_data_out_3] [get_bd_pins axi_ad9361_dac_fifo/din_data_3]
connect_bd_net -net bypass_tx_mux_data_out_3_net [get_bd_pins bypass_tx/mux_data_out_3] [get_bd_pins dac_latch/dac_data_in_3]
connect_bd_net -net gpio_mux_0_GPIO_IN_i_net [get_bd_pins gpio_mux_0/GPIO_IN_i] [get_bd_pins sys_ps7/GPIO_I]
connect_bd_net -net sys_ps7_GPIO_O_net [get_bd_pins sys_ps7/GPIO_O] [get_bd_pins gpio_mux_0/GPIO_IN_o]
connect_bd_net -net sys_ps7_GPIO_T_net [get_bd_pins sys_ps7/GPIO_T] [get_bd_pins gpio_mux_0/GPIO_IN_t]
connect_bd_net -net util_ad9361_divclk_clk_out_net [get_bd_pins util_ad9361_divclk/clk_out] [get_bd_pins util_mw_clkconstr/clk]
connect_bd_net [get_bd_pins util_ad9361_adc_fifo/dout_data_0] [get_bd_pins bypass_rx/bypass_data_in_0] [get_bd_pins ZynqBF_2t_ip_0/baseband_rx0I_in]
connect_bd_net [get_bd_pins util_ad9361_adc_fifo/dout_data_1] [get_bd_pins bypass_rx/bypass_data_in_1] [get_bd_pins ZynqBF_2t_ip_0/baseband_rx0Q_in]
connect_bd_net [get_bd_pins util_ad9361_adc_fifo/dout_valid_0] \
  [get_bd_pins bypass_rx/bypass_valid_in_0] [get_bd_pins ZynqBF_2t_ip_0/baseband_rx_valid_in]
connect_bd_net -net bypass_tx_mux_valid_out_0_net [get_bd_pins bypass_tx/mux_valid_out_0] \
  [get_bd_pins dac_latch/dac_valid] [get_bd_pins axi_ad9361_dac_fifo/din_valid_in_0] \
  [get_bd_pins axi_ad9361_dac_fifo/din_valid_in_1]
connect_bd_net -net util_ad9361_dac_upack_dac_valid_out_0_net [get_bd_pins util_ad9361_dac_upack/dac_valid_out_0] \
  [get_bd_pins bypass_tx/dut_valid_in] [get_bd_pins bypass_tx/bypass_valid_in_0]
connect_bd_net -net util_ad9361_dac_upack_dac_data_0_net [get_bd_pins util_ad9361_dac_upack/dac_data_0] \
  [get_bd_pins bypass_tx/bypass_data_in_0] [get_bd_pins bypass_tx/dut_data_in_0]
connect_bd_net -net axi_ad9361_dac_fifo_din_enable_0_net [get_bd_pins axi_ad9361_dac_fifo/din_enable_0] \
  [get_bd_pins util_ad9361_dac_upack/dac_enable_0]
connect_bd_net -net util_ad9361_dac_upack_dac_data_1_net [get_bd_pins util_ad9361_dac_upack/dac_data_1] \
  [get_bd_pins bypass_tx/bypass_data_in_1] [get_bd_pins bypass_tx/dut_data_in_1]
connect_bd_net -net axi_ad9361_dac_fifo_din_enable_1_net [get_bd_pins axi_ad9361_dac_fifo/din_enable_1] \
  [get_bd_pins util_ad9361_dac_upack/dac_enable_1]
connect_bd_net -net util_ad9361_dac_upack_dac_valid_out_2_net [get_bd_pins util_ad9361_dac_upack/dac_valid_out_2] \
  [get_bd_pins bypass_tx/bypass_valid_in_1]
connect_bd_net -net bypass_tx_mux_valid_out_1_net [get_bd_pins bypass_tx/mux_valid_out_1] \
  [get_bd_pins axi_ad9361_dac_fifo/din_valid_in_2] [get_bd_pins axi_ad9361_dac_fifo/din_valid_in_3]
connect_bd_net -net util_ad9361_dac_upack_dac_data_2_net [get_bd_pins util_ad9361_dac_upack/dac_data_2] \
  [get_bd_pins bypass_tx/bypass_data_in_2] [get_bd_pins bypass_tx/dut_data_in_2]
connect_bd_net -net axi_ad9361_dac_fifo_din_enable_2_net [get_bd_pins axi_ad9361_dac_fifo/din_enable_2] \
  [get_bd_pins util_ad9361_dac_upack/dac_enable_2]
connect_bd_net -net util_ad9361_dac_upack_dac_data_3_net [get_bd_pins util_ad9361_dac_upack/dac_data_3] \
  [get_bd_pins bypass_tx/bypass_data_in_3] [get_bd_pins bypass_tx/dut_data_in_3]
connect_bd_net -net axi_ad9361_dac_fifo_din_enable_3_net [get_bd_pins axi_ad9361_dac_fifo/din_enable_3] \
  [get_bd_pins util_ad9361_dac_upack/dac_enable_3]
connect_bd_net -net bypass_rx_mux_valid_out_0_net [get_bd_pins bypass_rx/mux_valid_out_0] \
  [get_bd_pins util_ad9361_adc_pack/adc_valid_0] [get_bd_pins util_ad9361_adc_pack/adc_valid_1]
connect_bd_net -net bypass_rx_mux_data_out_0_net [get_bd_pins bypass_rx/mux_data_out_0] [get_bd_pins util_ad9361_adc_pack/adc_data_0]
connect_bd_net -net util_ad9361_adc_fifo_dout_enable_0_net [get_bd_pins util_ad9361_adc_fifo/dout_enable_0] \
  [get_bd_pins util_ad9361_adc_pack/adc_enable_0]
connect_bd_net -net bypass_rx_mux_data_out_1_net [get_bd_pins bypass_rx/mux_data_out_1] [get_bd_pins util_ad9361_adc_pack/adc_data_1]
connect_bd_net -net util_ad9361_adc_fifo_dout_enable_1_net [get_bd_pins util_ad9361_adc_fifo/dout_enable_1] \
  [get_bd_pins util_ad9361_adc_pack/adc_enable_1]
connect_bd_net -net util_ad9361_adc_fifo_dout_valid_2_net [get_bd_pins util_ad9361_adc_fifo/dout_valid_2] [get_bd_pins bypass_rx/bypass_valid_in_1]
connect_bd_net -net bypass_rx_mux_valid_out_1_net [get_bd_pins bypass_rx/mux_valid_out_1] \
  [get_bd_pins util_ad9361_adc_pack/adc_valid_2] [get_bd_pins util_ad9361_adc_pack/adc_valid_3]
connect_bd_net -net bypass_rx_mux_data_out_2_net [get_bd_pins bypass_rx/mux_data_out_2] [get_bd_pins util_ad9361_adc_pack/adc_data_2]
connect_bd_net -net util_ad9361_adc_fifo_dout_enable_2_net [get_bd_pins util_ad9361_adc_fifo/dout_enable_2] \
  [get_bd_pins util_ad9361_adc_pack/adc_enable_2]
connect_bd_net -net util_ad9361_adc_fifo_dout_data_2_net [get_bd_pins util_ad9361_adc_fifo/dout_data_2] \
  [get_bd_pins bypass_rx/bypass_data_in_2] [get_bd_pins bypass_rx/dut_data_in_2]
connect_bd_net -net bypass_rx_mux_data_out_3_net [get_bd_pins bypass_rx/mux_data_out_3] [get_bd_pins util_ad9361_adc_pack/adc_data_3]
connect_bd_net -net util_ad9361_adc_fifo_dout_enable_3_net [get_bd_pins util_ad9361_adc_fifo/dout_enable_3] \
  [get_bd_pins util_ad9361_adc_pack/adc_enable_3]
connect_bd_net -net util_ad9361_adc_fifo_dout_data_3_net [get_bd_pins util_ad9361_adc_fifo/dout_data_3] \
  [get_bd_pins bypass_rx/bypass_data_in_3] [get_bd_pins bypass_rx/dut_data_in_3]
connect_bd_net [get_bd_pins xlconcat_0/dout] [get_bd_ports STATUS_LED]
connect_bd_net [get_bd_pins led_driver/led] [get_bd_pins xlconcat_0/In0] [get_bd_pins xlconcat_0/In1]
connect_bd_net [get_bd_pins sys_ps7/FCLK_RESET0_N] [get_bd_pins sys_rstgen/ext_reset_in] [get_bd_pins ZynqBF_2t_ip_0/ipcore_reset200n]
connect_bd_net -net sys_cpu_clk [get_bd_pins sys_ps7/FCLK_CLK0] \
  [get_bd_pins sys_rstgen/slowest_sync_clk] [get_bd_pins sys_ps7/DMA0_ACLK] [get_bd_pins sys_ps7/M_AXI_GP0_ACLK] \
  [get_bd_pins axi_iic_main/s_axi_aclk] [get_bd_pins util_ad9361_tdd_sync/clk] [get_bd_pins axi_ad9361/s_axi_aclk] \
  [get_bd_pins axi_ad9361_adc_dma/s_axi_aclk] [get_bd_pins axi_ad9361_dac_dma/s_axi_aclk] \
  [get_bd_pins sys_ps7/S_AXI_HP1_ACLK] [get_bd_pins axi_ad9361_adc_dma/m_dest_axi_aclk] [get_bd_pins sys_ps7/S_AXI_HP2_ACLK] \
  [get_bd_pins axi_ad9361_dac_dma/m_src_axi_aclk] [get_bd_pins bypass_tx/AXI4_Lite_ACLK] \
  [get_bd_pins bypass_rx/AXI4_Lite_ACLK] [get_bd_pins led_driver/clk_ps7] [get_bd_pins axi_cpu_interconnect/ACLK] \
  [get_bd_pins axi_cpu_interconnect/S00_ACLK] [get_bd_pins axi_cpu_interconnect/M00_ACLK] \
  [get_bd_pins axi_cpu_interconnect/M02_ACLK] [get_bd_pins axi_cpu_interconnect/M03_ACLK] \
  [get_bd_pins axi_cpu_interconnect/M04_ACLK] [get_bd_pins axi_cpu_interconnect/M05_ACLK] \
  [get_bd_pins axi_cpu_interconnect/M06_ACLK] [get_bd_pins axi_cpu_interconnect/M07_ACLK] \
  [get_bd_pins axi_hp1_interconnect/ACLK] [get_bd_pins axi_hp1_interconnect/M00_ACLK] \
  [get_bd_pins axi_hp1_interconnect/S00_ACLK] [get_bd_pins axi_hp2_interconnect/ACLK] \
  [get_bd_pins axi_hp2_interconnect/M00_ACLK] [get_bd_pins axi_hp2_interconnect/S00_ACLK] \
  [get_bd_pins axi_cpu_interconnect/M08_ACLK] [get_bd_pins axi_cpu_interconnect/M09_ACLK] \
  [get_bd_pins ZynqBF_2t_ip_0/ipcore_clk200]
connect_bd_net [get_bd_pins ZynqBF_2t_ip_0/dma_rx0I_out] [get_bd_pins bypass_rx/dut_data_in_0]
connect_bd_net [get_bd_pins ZynqBF_2t_ip_0/dma_rx0Q_out] [get_bd_pins bypass_rx/dut_data_in_1]
connect_bd_net [get_bd_pins ZynqBF_2t_ip_0/dma_rx_valid_out] [get_bd_pins bypass_rx/dut_valid_in]

# ---- address map ----
assign_bd_address -offset 0x00000000 -range 1G -target_address_space [get_bd_addr_spaces axi_ad9361_adc_dma/m_dest_axi] [get_bd_addr_segs sys_ps7/S_AXI_HP1/HP1_DDR_LOWOCM]
assign_bd_address -offset 0x00000000 -range 1G -target_address_space [get_bd_addr_spaces axi_ad9361_dac_dma/m_src_axi] [get_bd_addr_segs sys_ps7/S_AXI_HP2/HP2_DDR_LOWOCM]
assign_bd_address -offset 0x41600000 -range 4K -target_address_space [get_bd_addr_spaces sys_ps7/Data] [get_bd_addr_segs axi_iic_main/S_AXI/Reg]
assign_bd_address -offset 0x43C00000 -range 64K -target_address_space [get_bd_addr_spaces sys_ps7/Data] [get_bd_addr_segs ZynqBF_2t_ip_0/AXI4_Lite/reg0]
assign_bd_address -offset 0x43C20000 -range 64K -target_address_space [get_bd_addr_spaces sys_ps7/Data] [get_bd_addr_segs bypass_tx/AXI4_Lite/reg0]
assign_bd_address -offset 0x43C50000 -range 64K -target_address_space [get_bd_addr_spaces sys_ps7/Data] [get_bd_addr_segs bypass_rx/AXI4_Lite/reg0]
assign_bd_address -offset 0x79020000 -range 64K -target_address_space [get_bd_addr_spaces sys_ps7/Data] [get_bd_addr_segs axi_ad9361/s_axi/axi_lite]
assign_bd_address -offset 0x7C400000 -range 4K -target_address_space [get_bd_addr_spaces sys_ps7/Data] [get_bd_addr_segs axi_ad9361_adc_dma/s_axi/axi_lite]
assign_bd_address -offset 0x7C420000 -range 4K -target_address_space [get_bd_addr_spaces sys_ps7/Data] [get_bd_addr_segs axi_ad9361_dac_dma/s_axi/axi_lite]

validate_bd_design
save_bd_design
